# EAGLE schematic neo_retro_speedo_v1 (EAGLE 6.6.0)
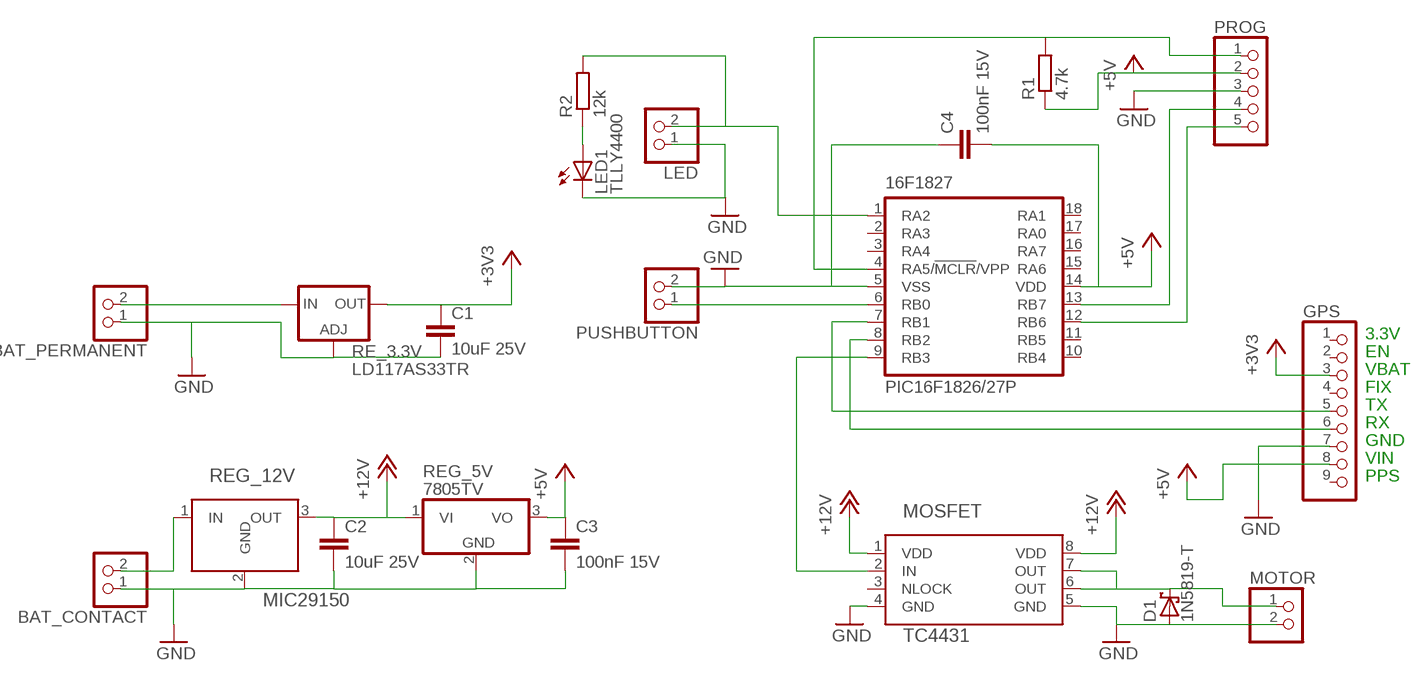
[diagram p0: schematic, sheet 1]

## Parts
16F1827  PIC16F1826/27P  [DIL18]
BAT_CONTACT  PINHD-1X2  [1X02]
BAT_PERMANENT  PINHD-1X2  [1X02]
C1  10uF 25V  C-EU025-030X050  [C025-030X050]
C2  10uF 25V  C-EU025-030X050  [C025-030X050]
C3  100nF 15V  C-EU025-030X050  [C025-030X050]
C4  100nF 15V  C-EU025-030X050  [C025-030X050]
D1  1N5819-T  [DO41-7.6]
GPS  PINHD-1X9  [1X09]
LED  PINHD-1X2  [1X02]
LED1  TLLY4400  [LED3MM]
MOSFET  TC4431  [DIL08]
MOTOR  PINHD-1X2  [1X02]
PROG  PINHD-1X5  [1X05]
PUSHBUTTON  PINHD-1X2  [1X02]
R1  4.7k  R-EU_0204/7  [0204/7]
R2  12k  R-EU_0204/7  [0204/7]
RE_3.3V  LD117AS33TR  [SOT223]
REG_5V  7805TV  [TO220V]
REG_12V  MIC29150  [TO220S]

## Nets
+3V3: C1.1 GPS.3 RE_3.3V.4(OUT)
+5V: 16F1827.14(VDD) C3.1 C4.2 GPS.8 PROG.2 R1.1 REG_5V.3(VO)
+12V: C2.1 MOSFET.1(VDD) MOSFET.8(VDD) REG_5V.1(VI) REG_12V.3(OUT)
GND: 16F1827.5(VSS) BAT_CONTACT.1 BAT_PERMANENT.1 C1.2 C2.2 C3.2 C4.1 D1.A GPS.7 LED1.K(C) LED.1 MOSFET.4(GND) MOSFET.5(GND) MOTOR.2 PROG.3 PUSHBUTTON.2 RE_3.3V.1(ADJ) REG_5V.2(GND) REG_12V.2(GND)
N$1: 16F1827.4(RA5/!MCLR!/VPP) PROG.1 R1.2
N$2: LED1.A R2.1
N$3: BAT_CONTACT.2 REG_12V.1(IN)
N$4: BAT_PERMANENT.2 RE_3.3V.3(IN)
N$5: 16F1827.6(RB0) PUSHBUTTON.1
N$6: 16F1827.13(RB7) PROG.4
N$7: 16F1827.12(RB6) PROG.5
N$9: 16F1827.7(RB1) GPS.5
N$10: 16F1827.8(RB2) GPS.6
N$12: 16F1827.1(RA2) LED.2 R2.2
N$13: 16F1827.9(RB3) MOSFET.2(IN)
N$18: D1.C MOSFET.6(OUT) MOSFET.7(OUT) MOTOR.1
Unconnected: 16F1827.2(RA3) 16F1827.3(RA4) 16F1827.10(RB4) 16F1827.11(RB5) 16F1827.15(RA6) 16F1827.16(RA7) 16F1827.17(RA0) 16F1827.18(RA1) GPS.1 GPS.2 GPS.4 GPS.9 MOSFET.3(NLOCK)

## Notes on the sheet
- 3.3V
- EN
- VBAT
- FIX
- TX
- RX
- GND
- VIN
- PPS

## Library data of the parts
16F1827 = microchip:PIC16*F1826/27: 18/20/28-Pin Flash Microcontrollers with nanoWatt XLP Technology Source: www.microchip.com PIC16F1827.pdf
BAT_CONTACT BAT_PERMANENT LED MOTOR PUSHBUTTON = pinhead:PINHD-1X2: PIN HEADER
C1-C4 = resistor:C-EU: CAPACITOR, European symbol
D1 = diode:1N581*: 1.0A SCHOTTKY BARRIER RECTIFIER Source: http://www.diodes.com/datasheets/ds23001.pdf
GPS = pinhead:PINHD-1X9: PIN HEADER
LED1 = led:TLLY4400: Low Current (2mA) LED 3 mm Tinted Diffused Package color YELLOW Source: Data sheet <http://www.farnell.com/datasheets/391098.pdf>; MF: VISHAY SEMICONDUCTOR; OC_FARNELL: 1612439
MOSFET = neo_retro_speedo:TC4431
PROG = pinhead:PINHD-1X5: PIN HEADER
R1 R2 = resistor:R-EU_: RESISTOR, European symbol
RE_3.3V = v-reg:LD117A?*: Low drop fixed and adjustable positive voltage regulators 1 A Source: http://www.st.com/stonline/products/literature/ds/7194/ld1117axx.pdf
REG_5V = linear:78*: Positive VOLTAGE REGULATOR Source: http://cache.national.com/ds/LM/LM78L05.pdf http://www.fairchildsemi.com/ds/LM/LM7805.pdf
REG_12V = neo_retro_speedo:MIC29150